# EAGLE design 3x4Matrix (EAGLE 7.6.0)
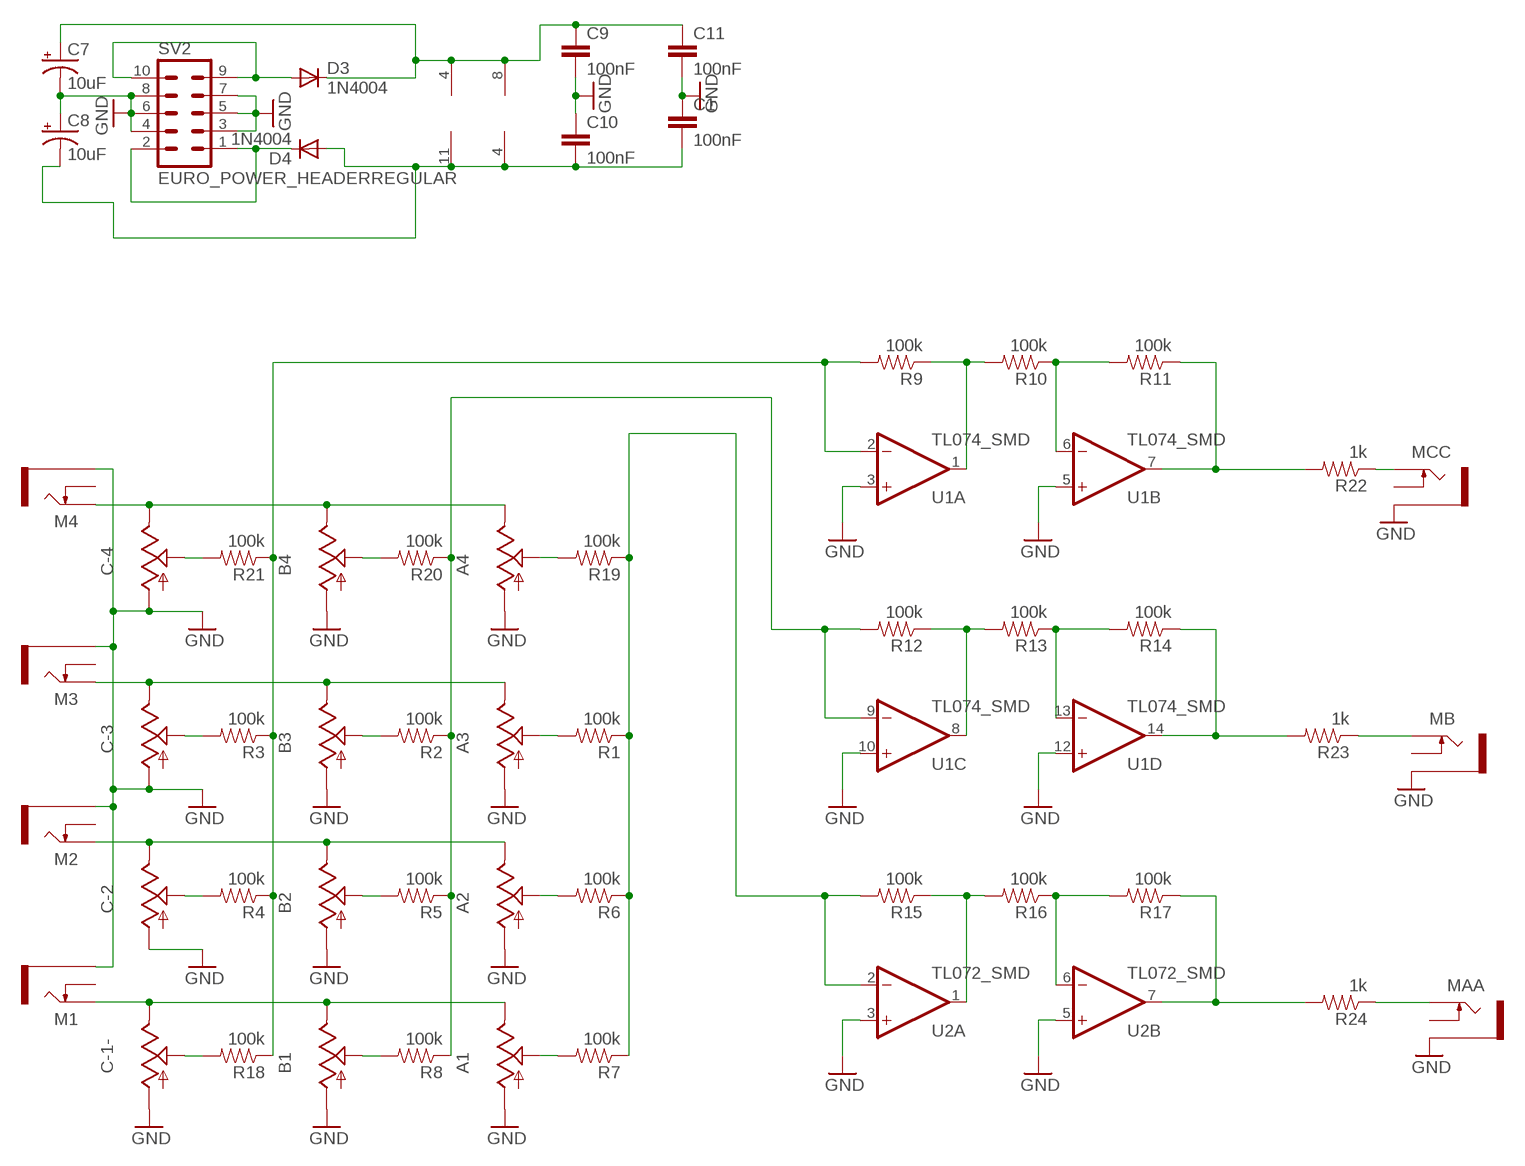
[diagram p0: schematic, sheet 1]

## Parts
A1  9MM_SNAP-IN_POT_  [9MM_SNAP-IN_POT]
A2  9MM_SNAP-IN_POT_  [9MM_SNAP-IN_POT]
A3  9MM_SNAP-IN_POT_  [9MM_SNAP-IN_POT]
A4  9MM_SNAP-IN_POT_  [9MM_SNAP-IN_POT]
B1  9MM_SNAP-IN_POT_  [9MM_SNAP-IN_POT]
B2  9MM_SNAP-IN_POT_  [9MM_SNAP-IN_POT]
B3  9MM_SNAP-IN_POT_  [9MM_SNAP-IN_POT]
B4  9MM_SNAP-IN_POT_  [9MM_SNAP-IN_POT]
C1  100nF  CAP0805  [0805]
C7  10uF  CAP_POLPTH2  [CPOL-RADIAL-10UF-25V]
C8  10uF  CAP_POLPTH2  [CPOL-RADIAL-10UF-25V]
C9  100nF  CAP0805  [0805]
C10  100nF  CAP0805  [0805]
C11  100nF  CAP0805  [0805]
C-1-  9MM_SNAP-IN_POT_  [9MM_SNAP-IN_POT]
C-2  9MM_SNAP-IN_POT_  [9MM_SNAP-IN_POT]
C-3  9MM_SNAP-IN_POT_  [9MM_SNAP-IN_POT]
C-4  9MM_SNAP-IN_POT_  [9MM_SNAP-IN_POT]
D3  1N4004  [DO41-10]
D4  1N4004  [DO41-10]
M1  THONKICONNNEW  [WQP-PJ301M-12_JACK]
M2  THONKICONNNEW  [WQP-PJ301M-12_JACK]
M3  THONKICONNNEW  [WQP-PJ301M-12_JACK]
M4  THONKICONNNEW  [WQP-PJ301M-12_JACK]
MAA  THONKICONNNEW  [WQP-PJ301M-12_JACK]
MB  THONKICONNNEW  [WQP-PJ301M-12_JACK]
MCC  THONKICONNNEW  [WQP-PJ301M-12_JACK]
R1  100k  RESISTOR0805-RES  [0805]
R2  100k  RESISTOR0805-RES  [0805]
R3  100k  RESISTOR0805-RES  [0805]
R4  100k  RESISTOR0805-RES  [0805]
R5  100k  RESISTOR0805-RES  [0805]
R6  100k  RESISTOR0805-RES  [0805]
R7  100k  RESISTOR0805-RES  [0805]
R8  100k  RESISTOR0805-RES  [0805]
R9  100k  RESISTOR0805-RES  [0805]
R10  100k  RESISTOR0805-RES  [0805]
R11  100k  RESISTOR0805-RES  [0805]
R12  100k  RESISTOR0805-RES  [0805]
R13  100k  RESISTOR0805-RES  [0805]
R14  100k  RESISTOR0805-RES  [0805]
R15  100k  RESISTOR0805-RES  [0805]
R16  100k  RESISTOR0805-RES  [0805]
R17  100k  RESISTOR0805-RES  [0805]
R18  100k  RESISTOR0805-RES  [0805]
R19  100k  RESISTOR0805-RES  [0805]
R20  100k  RESISTOR0805-RES  [0805]
R21  100k  RESISTOR0805-RES  [0805]
R22  1k  RESISTOR0805-RES  [0805]
R23  1k  RESISTOR0805-RES  [0805]
R24  1k  RESISTOR0805-RES  [0805]
SV2  EURO_POWER_HEADERREGULAR  [EURO_POWER_HEADER]
U1  TL074_SMD  [SO14]
U2  TL072_SMD  [SO08]

## Nets
+12UP1: D3.A SV2.9 SV2.10
-12UP1: D4.C SV2.1 SV2.2
C-11: R3.1 R4.1 R9.2 R18.1 R21.1 U1.2(A:-IN)
GND: A1.1(A) A2.1(A) A3.1(A) A4.1(A) B1.1(A) B2.1(A) B3.1(A) B4.1(A) C1.1 C7.2(-) C8.1(+) C9.2 C10.1 C11.2 C-1-.1(A) C-2.1(A) C-3.1(A) C-4.1(A) M1.P$3_SLEEVE(SLEEVE) M2.P$3_SLEEVE(SLEEVE) M3.P$3_SLEEVE(SLEEVE) M4.P$3_SLEEVE(SLEEVE) MAA.P$3_SLEEVE(SLEEVE) MB.P$3_SLEEVE(SLEEVE) MCC.P$3_SLEEVE(SLEEVE) SV2.3 SV2.4 SV2.5 SV2.6 SV2.7 SV2.8 U1.3(A:+IN) U1.5(B:+IN) U1.10(C:+IN) U1.12(D:+IN) U2.3(A:+IN) U2.5(B:+IN)
N$1: A3.2(S) R1.2
N$2: B3.2(S) R2.2
N$3: C-3.2(S) R3.2
N$4: C-2.2(S) R4.2
N$5: B2.2(S) R5.2
N$6: A2.2(S) R6.2
N$7: B1.2(S) R8.2
N$8: C-1-.2(S) R18.2
N$9: A1.2(S) R7.2
N$10: A4.3(E) B4.3(E) C-4.3(E) M4.P$1_TIP(TIP)
N$11: MCC.P$1_TIP(TIP) R22.1
N$12: C1.2 C8.2(-) C10.2 D4.A U1.11(P:V-) U2.4(P:V-)
N$13: A4.2(S) R19.2
N$14: B4.2(S) R20.2
N$15: C-4.2(S) R21.2
N$16: MB.P$1_TIP(TIP) R23.1
N$17: MAA.P$1_TIP(TIP) R24.1
N$18: R1.1 R6.1 R7.1 R15.2 R19.1 U2.2(A:-IN)
N$21: A3.3(E) B3.3(E) C-3.3(E) M3.P$1_TIP(TIP)
N$22: A2.3(E) B2.3(E) C-2.3(E) M2.P$1_TIP(TIP)
N$23: A1.3(E) B1.3(E) C-1-.3(E) M1.P$1_TIP(TIP)
N$24: R12.1 R13.2 U1.8(C:OUT)
N$25: R10.1 R11.2 U1.6(B:-IN)
N$26: R2.1 R5.1 R8.1 R12.2 R20.1 U1.9(C:-IN)
N$27: R11.1 R22.2 U1.7(B:OUT)
N$28: R13.1 R14.2 U1.13(D:-IN)
N$29: R14.1 R23.2 U1.14(D:OUT)
N$32: R16.1 R17.2 U2.6(B:-IN)
N$33: R17.1 R24.2 U2.7(B:OUT)
N$35: C7.1(+) C9.1 C11.1 D3.C U1.4(P:V+) U2.8(P:V+)
PIN1: R9.1 R10.2 U1.1(A:OUT)
PINN1: R15.1 R16.2 U2.1(A:OUT)
Unconnected: M1.P$2_SWITCH(SWITCH) M2.P$2_SWITCH(SWITCH) M3.P$2_SWITCH(SWITCH) M4.P$2_SWITCH(SWITCH) MAA.P$2_SWITCH(SWITCH) MB.P$2_SWITCH(SWITCH) MCC.P$2_SWITCH(SWITCH)

## Library data of the parts
A1-A4 B1-B4 C-1- C-2-C-4 = MusicThingModular:9MM_SNAP-IN_POT: 9mm vertical snap-in pot, Alpha / Panasonic style
C1 C9-C11 = SparkFun:CAP: Capacitor Standard 0603 ceramic capacitor, and 0.1" leaded capacitor.
C7 C8 = SparkFun-Capacitors:CAP_POL: Capacitor Polarized These are standard SMD and PTH capacitors. Normally 10uF, 47uF, and 100uF in electrolytic and tantalum varieties. Always verify the external diameter of the through hole cap, it varies with capacity, voltage, and manufacturer. The EIA devices should be standard.
D3 D4 = _mod_diode:1N4004: DIODE general purpose rectifier, 1 A
M1-M4 MAA MB MCC = MusicThingModular:THONKICONN: 3.5mm socket for Eurorack modular synths
R1-R24 = SparkFun-Passives:RESISTOR: Resistor Basic schematic elements and footprints for 0603, 1206, and PTH resistors.
SV2 = MusicThingModular:EURO_POWER_HEADER: Power Header 10 pin power header for Eurorack Power Supplies Variants with fatter pads for easier soldering, and the LOCK variant which has 5mil offset pins to hold the component in place before soldering
U1 = MusicThingModular:TL074: Generic Quad Op Amp
U2 = MusicThingModular:TL072: Generic Dual Op Amp

## Board
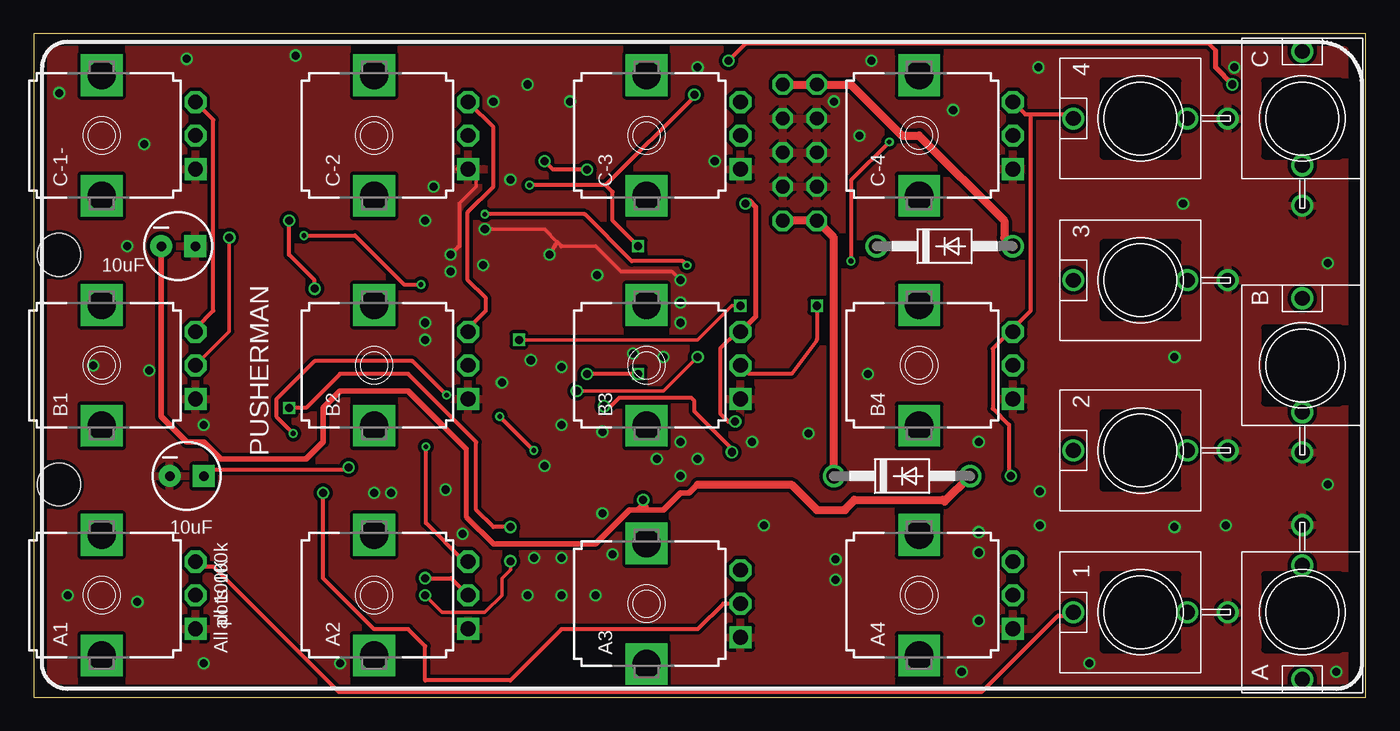
[diagram p1: board, top side]
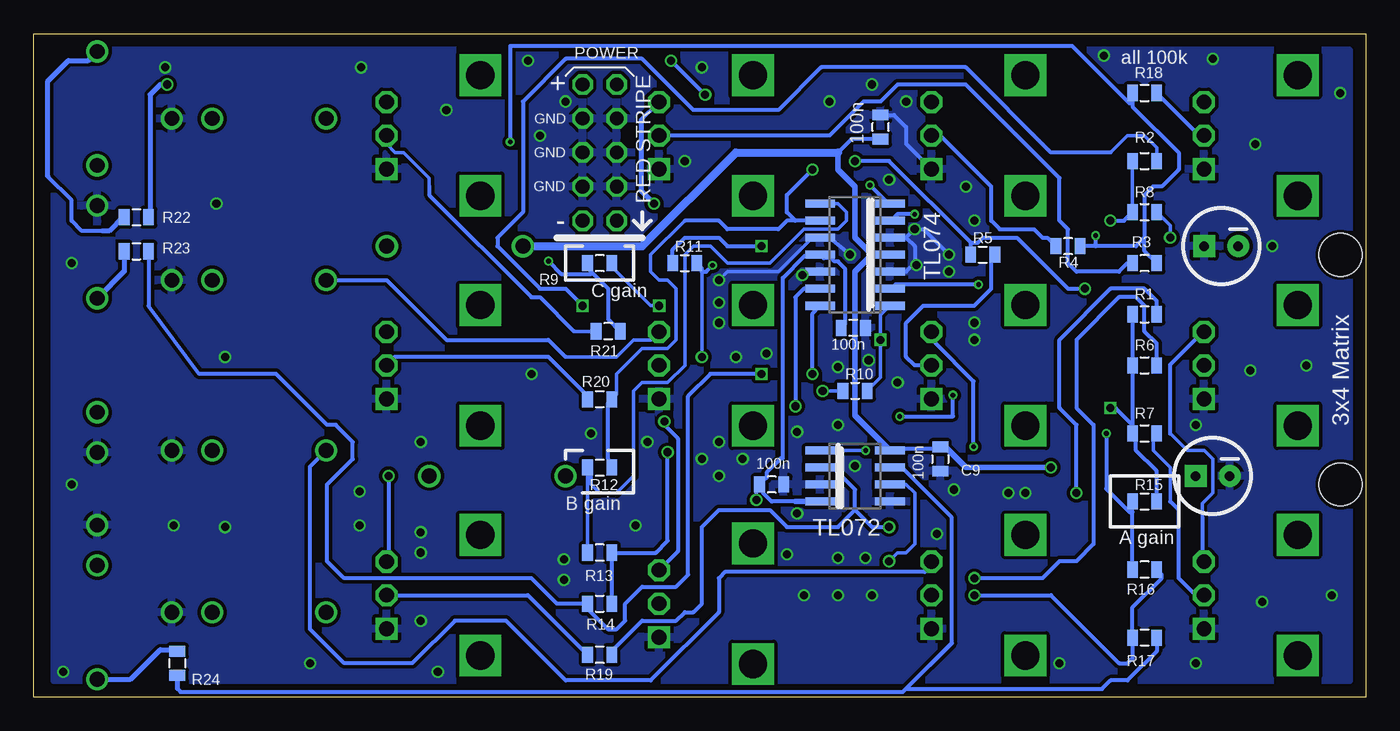
[diagram p2: board, bottom side, seen from below]

Size 99.36 x 49.52 mm. Coordinates in mm from the lower left corner, seen from the top.
Outline: 0,0 99.36,0 99.36,49.52 0,49.52 0,0
Copper layers (1*16): Top 0.035mm / dielectric 1.5mm / Bottom 0.035mm
Design rules "dirt_cheap_dirty_boards.v1": minimum track width 5mil, minimum drill 12mil, track to track 5mil, track to pad 5mil, pad to pad 5mil, via to via 5mil, smd to smd 0mil, copper to edge 10mil, drill to drill 10mil, minimum pad ring 10mil, minimum via ring 6mil, stop-mask expansion 2mil, vias tented up to drill 25mil, thermal gap 10mil
Holes 3.2 mm at 1.91,15.88 1.91,33.02

### Footprints (pad centres in the part's own frame; a part is rotated, then mirrored left to right if it is on the bottom)
9MM_SNAP-IN_POT = drill 1.1 square: 1 -2.5,-7 | drill 1.1 octagon: 2 0,-7; 3 2.5,-7 | drill 2.1 square: CHASSIS1 -4.5,0; CHASSIS2 4.5,0
0805 = smd 0.8 x 1.2: 1 -0.9,0; 2 0.9,0
CPOL-RADIAL-10UF-25V = drill 0.7 pad 1.651 square: 1 1.27,0 | drill 0.7 pad 1.651: 2 -1.27,0
DO41-10 = drill 1.118: A 5.08,0; C -5.08,0
WQP-PJ301M-12_JACK = drill 1.1: P$1_TIP 0,5; P$2_SWITCH 0,-3.5; P$3_SLEEVE 0,-6.5
EURO_POWER_HEADER = drill 1.016 octagon: 1 -5.08,-1.27; 2 -5.08,1.27; 3 -2.54,-1.27; 4 -2.54,1.27; 5 0,-1.27; 6 0,1.27; 7 2.54,-1.27; 8 2.54,1.27; 9 5.08,-1.27; 10 5.08,1.27
SO14 = smd 0.6 x 2.2: 1 -3.81,-2.6; 2 -2.54,-2.6; 3 -1.27,-2.6; 4 0,-2.6; 5 1.27,-2.6; 6 2.54,-2.6; 7 3.81,-2.6; 8 3.81,2.6; 9 2.54,2.6; 10 1.27,2.6; 11 0,2.6; 12 -1.27,2.6; 13 -2.54,2.6; 14 -3.81,2.6
SO08 = smd 0.6 x 2.2: 1 -1.905,-2.6; 2 -0.635,-2.6; 3 0.635,-2.6; 4 1.905,-2.6; 5 1.905,2.6; 6 0.635,2.6; 7 -0.635,2.6; 8 -1.905,2.6

### Placement (x,y rotation side)
A1  5.08,7.62 90 top
A2  25.4,7.62 90 top
A3  45.72,6.99 90 top
A4  66.04,7.62 90 top
B1  5.08,24.77 90 top
B2  25.4,24.77 90 top
B3  45.72,24.77 90 top
B4  66.04,24.77 90 top
C1  38.23,27.56 180 bottom
C7  11.43,16.51 0 top
C8  10.79,33.66 0 top
C9  31.75,17.78 270 bottom
C10  44.32,15.88 180 bottom
C11  36.2,42.55 90 bottom
C-1-  5.08,41.91 90 top
C-2  25.4,41.91 90 top
C-3  45.72,41.91 90 top
C-4  66.04,41.91 90 top
D3  67.94,33.66 0 top
D4  64.77,16.51 0 top
M1  82.55,6.35 90 top
M2  82.55,18.41 90 top
M3  82.55,31.11 90 top
M4  82.55,43.18 90 top
MAA  94.61,6.35 180 top
MB  94.61,24.77 0 top
MCC  94.61,43.18 0 top
R1  16.51,28.57 0 bottom
R2  16.51,40.01 0 bottom
R3  16.51,32.38 180 bottom
R4  22.23,33.66 180 bottom
R5  28.57,33.02 0 bottom
R6  16.51,24.77 0 bottom
R7  16.51,19.68 0 bottom
R8  16.51,36.2 0 bottom
R9  57.15,32.38 180 bottom
R10  38.1,22.86 0 bottom
R11  50.8,32.38 0 bottom
R12  57.15,17.14 0 bottom
R13  57.15,10.79 180 bottom
R14  57.15,6.99 0 bottom
R15  16.51,14.61 0 bottom
R16  16.51,9.53 180 bottom
R17  16.51,4.45 180 bottom
R18  16.51,45.09 0 bottom
R19  57.15,3.17 180 bottom
R20  57.15,22.23 180 bottom
R21  56.52,27.3 180 bottom
R22  91.69,35.81 0 bottom
R23  91.69,33.27 0 bottom
R24  88.65,2.54 270 bottom
SV2  57.15,40.64 90 bottom
U1  38.1,33.02 90 bottom
U2  38.1,16.51 270 bottom

### Tracks (layer width: path | path; a pad name or v marks a point on that pad's centre or on a via)
+12UP1
  Top 0.61: SV2.9 SV2.10 60.96,45.72 64.77,41.91 66.04,41.91 72.39,35.56 72.39,34.29 D3.A
-12UP1
  Top 0.61: D4.C 59.69,34.29 SV2.2 SV2.1
C-11  (via drill 0.36)
  Top 0.305: v28.89,30.8 27.62,30.8 23.97,34.45 v20.16,34.45 | v60.96,32.54 60.96,38.58 v63.82,41.43
  Bottom 0.305: R18.1 17.41,44.29 | 17.41,44.29 17.41,44.08 13.97,40.64 13.97,39.37 15.24,38.1 15.88,38.1 16.51,37.47 16.51,34.29 | R3.1 16.51,33.28 16.51,34.29 | 16.51,34.29 17.14,33.66 20.16,33.66 | 20.16,33.66 R4.1 | R9.2 58.05,32.02 57.71,31.67 | 57.71,31.67 56.52,30.48 56.52,28.2 R21.1 | v28.89,30.8 35.08,30.8 35.4,30.48 U1.2 | 20.16,33.66 v20.16,34.45 | v60.96,32.54 60.01,31.59 57.78,31.59 57.71,31.67 | v63.82,41.43 63.82,48.58 21.91,48.58 17.62,44.29 17.41,44.29
GND  (via drill 0.6)
  Top 0.254: v33.66,34.92 38.1,34.92 39.05,33.97 v38.48,33.02 | 39.37,33.66 41.91,33.66 43.81,31.75 47.62,31.75 v48.26,31.11 | 31.75,36.83 33.02,38.1 33.02,38.79 C-2.1
  Top 0.305: 58.42,40.8 SV2.6 | 39.37,33.66 39.05,33.97 | 31.75,36.83 31.75,33.66 v31.11,33.02
  Top 0.406: C-2.1 31.71,39.41
  Bottom 0.254: v48.26,31.11 47.62,31.75 43.81,31.75 41.27,34.29 U1.10
  Bottom 0.305: v38.48,33.02 40.01,34.29 | U1.5 34.29,34.29 | 34.29,34.29 33.66,33.66 33.66,32.38 34.29,31.75 U1.3 | 34.29,34.29 v33.66,34.92 33.02,34.92 v31.11,33.02 | C11.2 35.19,43.45 34.29,42.55 34.29,41.3 C-2.1 | 39.75,15.88 U2.3 40.83,15.75 41.4,15.75 41.53,15.88
  Bottom 0.356: U1.12 41.78,31.75 v42.04,31.5
  other vias: 41.91,7.62 22.86,2.54 12.7,2.54 2.54,7.62 8.64,24.38 7.75,7.11 4.45,24.77 6.99,33.66 1.91,45.09 11.43,47.62 8.26,41.27 19.56,47.88 29.84,38.1 40.01,44.45 50.8,40.01 68.58,43.81 74.93,46.99 89.53,46.99 85.72,36.83 96.52,32.38 85.09,25.4 96.52,15.88 85.09,12.7 88.9,12.83 97.16,1.91 78.74,2.54 69.22,1.91 70.48,5.71 70.48,10.79 70.48,19.05 57.78,19.68 34.92,23.5 12.7,20.32 31.11,31.75 48.26,27.94 62.23,24.13 61.59,41.91 59.69,44.45 39.37,20.32 25.4,15.24 26.67,15.24 36.83,7.62 39.37,7.62 29.21,26.67 29.21,27.94 29.21,35.56 46.99,25.4 48.26,19.05 48.26,16.51 49.53,17.78 49.53,46.99 30.73,15.49 32,12.19 37.34,10.41 39.37,10.41 43.18,10.67 42.42,13.72 42.42,19.81 46.48,17.78 38.1,17.27 39.37,24.64 48.26,29.46 33.53,32.26 35.56,38.61 34.29,44.45 36.83,45.72 62.48,47.5 37.08,25.15 44.7,25.65 53.59,19.05 54.48,12.83 59.82,8.76 59.82,10.29 70.48,12.32 75.06,15.37 75.06,12.83
  pour Top (isolate 0.254): 1.27,48.26 1.27,1.27 97.79,1.27 97.79,48.26
  pour Bottom (isolate 0.254): 1.27,48.26 1.27,1.27 97.79,1.27 97.79,48.26
N$1  (via drill 0.6)
  Top 0.305: A3.2 51.44,6.99 49.53,5.08 39.37,5.08 35.56,1.27 29.21,1.27 29.21,3.81 27.94,5.08 25.4,5.08 21.59,8.89 v21.59,15.24
  Bottom 0.305: R1.2 15.61,29.58 16.51,30.48 19.05,30.48 22.86,26.67 22.86,21.59 21.59,20.32 v21.59,15.24
N$2  (via drill 0.6)
  Top 0.305: v58.42,29.21 58.42,26.67 56.52,24.13 53.35,24.13 B3.2
  Bottom 0.254: R2.2 15.61,41.01 16.51,41.91 17.78,41.91 19.05,40.64
  Bottom 0.305: 19.05,40.64 23.5,40.64 29.84,46.99 40.64,46.99 43.81,43.81 50.16,43.81 53.98,47.62 59.69,47.62 62.87,44.45 62.87,36.2 64.77,34.29 64.77,33.66 61.59,30.48 59.69,30.48 v58.42,29.21
N$3
  Bottom 0.305: R3.2 17.78,32.38 18.41,31.75 21.59,31.75 22.23,32.38 22.23,34.92 22.86,35.56 22.86,38.73 29.84,45.72 34.92,45.72 36.2,44.45 37.47,44.45 40.01,41.91 C-3.2
N$4
  Bottom 0.305: C-2.2 31.75,41.91 27.94,38.1 27.94,35.56 27.3,34.92 24.77,34.92 24.13,34.29 23.76,34.29 R4.2
N$5
  Bottom 0.305: B2.2 33.66,24.77 34.29,25.4 34.29,27.94 33.02,29.21 29.21,29.21 27.94,30.48 27.94,33.39 R5.2
N$6  (via drill 0.6)
  Top 0.305: v29.21,8.89 31.13,8.89 A2.2
  Bottom 0.305: R6.2 15.61,26.41 16.51,27.3 16.51,29.21 17.14,29.84 18.41,29.84 21.59,26.67 21.59,21.59 20.32,20.32 20.32,11.43 21.59,10.16 22.86,10.16 24.13,8.89 v29.21,8.89
N$7  (via drill 0.6)
  Top 0.254: B1.2 14.61,27.3 v14.61,34.29
  Bottom 0.254: v14.61,34.29 14.61,35.19 R8.2
N$8
  Bottom 0.305: C-1-.2 12.44,41.91 R18.2
N$9
  Bottom 0.254: 14.61,14.61 14.61,17.14 15.88,18.41 15.88,19.42 R7.2
  Bottom 0.305: A1.2 12.7,7.62 13.97,8.89 13.97,13.97 14.61,14.61
N$10  (via drill 0.6)
  Top 0.305: 74.37,43.48 73.97,43.48 73.15,44.3 C-4.3 | 74.37,43.48 77.22,43.48 M4.P$1_TIP | 74.37,43.48 74.37,28.85 73.15,27.64 B4.3 72.75,27.23 71.53,26.01 71.53,21.54 72.75,20.32 72.75,16.66 v72.9,16.51
  Bottom 0.305: v72.9,16.51 72.9,10.26 A4.3
N$11
  Bottom 0.305: 94.23,34.8 95.76,34.8 96.52,35.56 96.52,37.08 98.3,38.86
  Bottom 0.356: R22.1 92.71,35.81 93.73,34.8 94.23,34.8 | 98.3,38.86 98.3,45.97 96.77,47.5 95.3,47.5 MCC.P$1_TIP
N$12  (via drill 0.6)
  Top 0.305: 44.45,13.97 44.96,13.97 45.47,14.48 45.72,14.22 45.47,14.22 v45.47,14.73
  Top 0.356: 30.48,20.32 32.26,18.54 32.26,13.46 34.29,11.43
  Top 0.406: C8.2 9.53,20.95 11.43,19.05 12.7,19.05 13.97,17.78 20.32,17.78 21.59,19.05 21.59,21.59 22.86,22.86 27.94,22.86 30.48,20.32 | 34.29,11.43 41.91,11.43 44.45,13.97 46.99,13.97 48.26,15.24 48.9,15.24 49.53,15.88
  Top 0.61: 49.53,15.88 56.52,15.88 58.42,13.97 60.52,13.97 60.52,14.04 61.21,14.73 67.82,14.73 67.94,14.61 D4.A
  Bottom 0.305: 42.55,14.61 44.32,14.61 44.96,15.24 44.96,15.61 C10.2 | C10.2 44.7,16.39 44.7,16.76 43.64,17.83 43.48,17.83 43.48,31.29 41.86,32.92 41.05,32.92 U1.11 40.45,32.77 39.88,32.77 39.62,32.51 39.37,32.51 38.86,32 38.86,27.82 C1.2 | v45.47,14.73 45.47,15.63 C10.2
  Bottom 0.406: U2.4 42.55,14.61
N$13
  Bottom 0.305: A4.2 62.49,7.62 R19.2
N$14
  Bottom 0.305: R20.2 58.05,22.49 60.96,25.4 72.41,25.4 B4.2
N$15
  Bottom 0.254: R21.2 59.05,27.3 | 73.04,41.29 72.39,40.64 71.75,40.64 69.85,38.73 69.85,38.1
  Bottom 0.305: C-4.2 73.04,41.29 | 69.85,38.1 69.85,37.47 62.23,29.84 61.59,29.84 59.05,27.3
N$16
  Bottom 0.356: R23.1 92.59,31.79 MB.P$1_TIP
N$17
  Bottom 0.356: MAA.P$1_TIP 92.12,1.35 89.92,3.56 88.76,3.56 R24.1
N$18  (via drill 0.6)
  Top 0.305: v35.56,12.7 34.29,12.7 33.02,13.97 33.02,19.05 27.94,24.13 22.86,24.13 20.32,21.59 v19.05,21.59
  Bottom 0.305: R19.1 56.25,3.44 53.98,5.71 51.44,5.71 50.8,6.35 50.16,6.35 49.53,6.99 49.53,12.7 48.26,13.97 44.45,13.97 43.18,12.7 39.37,12.7 38.1,13.97 | R15.2 15.61,16.88 17.14,18.41 17.14,19.42 R7.1 17.41,20.32 | R1.1 R6.1 17.41,20.32 | 38.1,13.97 36.83,12.7 v35.56,12.7 | v19.05,21.59 18.68,21.59 17.41,20.32 | U2.2 39.75,17.14 38.1,15.49 38.1,13.97
N$21  (via drill 0.6)
  Top 0.305: 52.83,27.64 B3.3 52.43,27.23 51.21,26.01 51.21,21.18 51.82,20.57 v52.32,20.57
  Top 0.356: v53.09,36.83 53.34,37.08 53.85,36.58 53.85,28.39 B3.3
  Bottom 0.254: 59.69,25.4 55.88,25.4 54.61,26.67 53.31,26.67 B3.3
  Bottom 0.305: 52.83,27.64 B3.3 | M3.P$1_TIP 73.03,31.11 68.58,26.67 60.96,26.67 59.69,25.4 | 52.7,9.53 52.7,9.5 A3.3 | A3.3 52.72,9.51 52.7,9.53 | 52.43,9.75 52.48,9.75 52.7,9.53 | v52.32,20.57 52.32,20.32 51.31,19.3 51.31,10.9 A3.3 | 52.87,44.41 52.87,44.26 54.05,43.08
  Bottom 0.356: C-3.3 52.87,44.41 | 54.05,43.08 54.05,37.8 v53.09,36.83
N$22  (via drill 0.36)
  Top 0.305: C-2.3 32.51,44.3 34.29,42.52 34.29,38.1 32.38,36.2 32.38,31.11 33.73,29.77 33.73,28.85 32.51,27.64 B2.3 | v29.26,18.69 29.26,13.01 32.11,10.16 A2.3
  Bottom 0.305: 77.22,18.29 M2.P$1_TIP 78.74,17.23 78.74,5.08 76.2,2.54 71.12,2.54 67.94,5.71 64.14,5.71 59.69,1.27 53.34,1.27 48.26,6.35 48.26,8.89 47.8,9.35 32.92,9.35 32.51,9.75 A2.3 | v29.26,18.69 29.26,23.57 32.11,26.42 32.11,27.23 B2.3
N$23
  Top 0.305: C-1-.3 12.19,44.3 13.41,43.08 13.41,28.85 12.19,27.64 B1.3 | M1.P$1_TIP 77.22,6.1 76.4,6.1 70.71,0.41 22.76,0.41 13.41,9.75 12.19,9.75 A1.3
  Bottom 0.254: 12.19,13.41 12.19,14.48 11.43,15.24 11.43,17.78 12.06,18.41 13.34,18.41 14.61,19.68
  Bottom 0.305: 12.19,13.41 12.19,10.16 A1.3 | B1.3 12.19,27.23 14.61,24.82 14.61,19.68
N$24
  Bottom 0.254: U1.8 39.37,36.83 38.73,36.2 38.73,35.56 39.37,34.92 41.91,34.92 44.45,32.38 47.62,32.38 48.9,33.66 50.16,33.66 50.8,33.02 50.8,24.77 52.07,23.5 53.98,23.5 54.61,22.86 54.61,16.51 55.88,15.24 57.15,15.24 57.78,15.88 57.78,16.88 R12.1 R13.2
N$25  (via drill 0.36, 0.6)
  Top 0.254: v40.51,22.86 46.99,22.86 v49.53,25.4
  Top 0.305: v33.66,36.04 41.12,36.04 44.61,32.54 48.42,32.54 v48.74,32.23
  Bottom 0.254: R10.1 v40.51,22.86 | v49.53,25.4 49.53,31.75 49.53,32.02 R11.2
  Bottom 0.305: v33.66,36.04 34.92,36.04 35.4,35.56 U1.6 | v48.74,32.23 49.21,31.75 49.53,31.75
N$26  (via drill 0.6)
  Top 0.305: v41.27,39.37 38.73,39.37 v38.1,40.01 | v20.95,30.48 20.95,31.11 19.05,33.02 v19.05,35.56
  Bottom 0.254: 56.52,17.78 56.52,17.41 R12.2 | R20.1 55.88,22.59 55.88,24.13 53.98,26.04 52.07,26.04 51.44,26.67 51.44,30.48 52.07,31.11 52.7,31.11 53.34,31.75 53.34,33.02 50.8,35.56 | R2.1 R8.1
  Bottom 0.305: 56.52,17.78 56.52,21.96 R20.1 | R5.1 29.48,33.92 | 29.48,33.92 35.56,40.01 v38.1,40.01 | v41.27,39.37 43.18,37.47 43.18,36.2 42.55,35.56 U1.9 43.18,35.56 43.81,34.92 47.62,34.92 48.26,35.56 50.8,35.56 | 29.48,33.92 28.95,33.92 28.57,34.29 26.04,34.29 22.23,30.48 v20.95,30.48 | v19.05,35.56 18.05,35.56 R8.1
N$27  (via drill 0.36, 0.6)
  Top 0.305: 42.67,38.2 v36.98,38.2 | v45.09,33.66 43.18,35.56 43.18,37.69 42.67,38.2 | v51.82,47.5 53.09,48.77 87.63,48.77 88.14,48.26 | v49.28,44.96 49.28,44.81 42.67,38.2
  Top 0.356: 88.14,48.26 88.14,46.99 v89.41,45.72
  Bottom 0.305: v36.98,38.2 35.76,36.98 U1.7 | R11.1 51.7,33.39 50.8,34.29 48.26,34.29 47.62,33.66 v45.09,33.66 | v51.82,47.5 v49.28,44.96
  Bottom 0.356: v89.41,45.72 89.92,45.72 90.68,44.96 90.68,35.93 R22.2
N$28  (via drill 0.6)
  Top 0.305: v42.55,21.72 43.05,21.72 43.69,22.35 49.02,22.35 49.28,22.1 49.28,21.34 52.07,18.54 v52.07,18.29
  Bottom 0.305: R14.2 R13.1 52.96,10.79 52.07,11.68 v52.07,18.29 | U1.13 41.91,30.48 42.55,29.84 v42.55,21.72
N$29  (via drill 0.6)
  Top 0.305: v45.09,24.13 v41.27,24.13
  Bottom 0.305: v41.27,24.13 41.27,28.64 U1.14 | v45.09,24.13 48.9,24.13 50.55,22.48 50.55,9.14 51.44,8.26 53.98,8.26 55.24,6.99 55.24,5.71 55.88,5.08 56.52,5.08 58.05,6.62 R14.1 60.33,6.99 62.23,8.89 76.2,8.89 77.47,10.16 77.47,15.88 75.56,17.78 75.56,19.05 76.83,20.32 77.47,20.32 81.28,24.13 87,24.13 90.79,29.2 R23.2
N$32  (via drill 0.6)
  Top 0.254: v35.56,10.16 35.56,9.53 34.92,8.89 34.92,7.62 33.66,6.35 30.48,6.35 v29.21,7.62
  Bottom 0.254: U2.6 34.29,15.88 33.66,15.24 33.66,11.43 34.29,10.79 34.92,10.79 v35.56,10.16
  Bottom 0.305: v29.21,7.62 23.5,7.62 18.41,2.54 17.78,2.54 17.41,2.91 R17.2 17.41,6.72 15.24,8.89 15.24,9.15 R16.1
N$33
  Bottom 0.305: 30.89,4.06 30.89,13.41 34.54,17.07 35.36,17.07 U2.7 | 30.89,4.06 34.54,0.41 88.39,0.41 88.65,0.66 | 30.89,4.06 30.89,4.04 34.29,0.64 19.68,0.64 19.05,1.27 17.78,1.27 15.61,3.44 R17.1
  Bottom 0.356: R24.2 88.65,0.66
N$35  (via drill 0.6)
  Top 0.305: 13.21,17.02 23.37,17.02 v23.5,17.14
  Top 0.406: 13.21,17.02 C7.1
  Bottom 0.305: U2.8 35.4,18.57 31.86,18.57 C9.1 | C11.1 38.37,41.65 39.37,40.64
  Bottom 0.406: 39.37,40.64 39.37,39.37 38.1,38.1 38.1,34.29 36.83,33.02 | U1.4 36.83,33.02 | 36.83,33.02 38.1,31.75 38.1,21.02 U2.8 | C9.1 31.38,18.68 29.84,17.14 v23.5,17.14
  Bottom 0.61: D3.C 53.98,33.66 46.99,40.64 39.37,40.64
PIN1  (via drill 0.6)
  Top 0.254: v52.7,29.21 52.07,29.21 49.53,26.67 v36.2,26.67
  Bottom 0.254: R9.1 56.25,32.12 53.34,29.21 v52.7,29.21 | U1.1 36.2,28.52 v36.2,26.67 36.2,23.86 R10.2
PINN1  (via drill 0.36)
  Top 0.305: v19.37,19.68 18.1,20.95 18.1,22.23 20.95,25.08 28.26,25.08 v30.8,22.54 | v37.31,18.41 v34.77,20.95
  Bottom 0.254: U2.1 37.47,18.41 37.39,18.34
  Bottom 0.305: R16.2 17.41,13.81 | 17.41,13.81 R15.1 | 17.41,13.81 17.62,13.81 19.37,15.56 v19.37,19.68 | v30.8,22.54 30.8,20.95 v34.77,20.95 | v37.31,18.41 37.39,18.34

### Text on the board
tPlace: C | 4 | 3 | 10uF | B | 2 | PUSHERMAN | 10uF | 1 | all 100K | All pots 100k | A
bPlace: all 100k | 100n | TL074 | C gain | 3x4 Matrix | 100n | 100n | C9 | 100n | B gain | TL072 | A gain